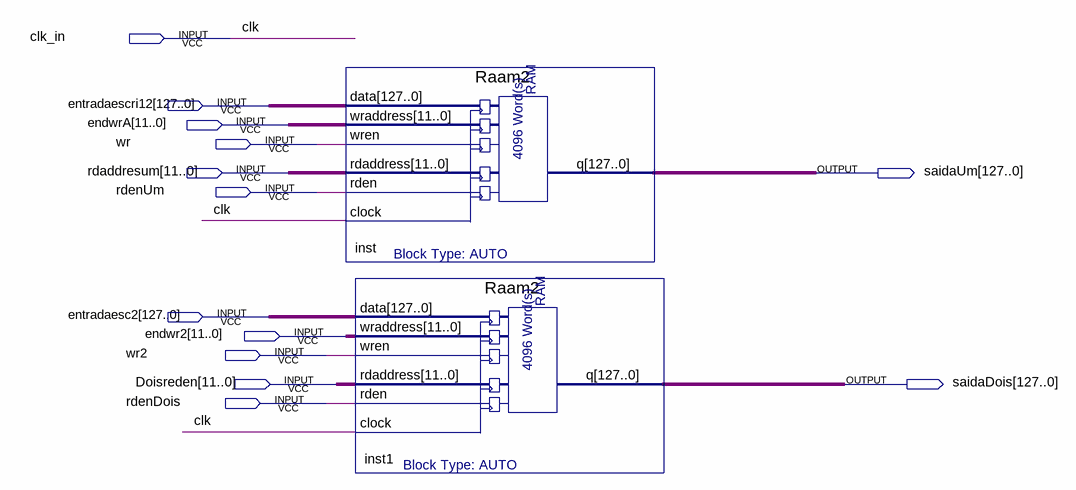
[diagram p0: schematic sheet]
// Quartus schematic DualRam2.bdf as structural Verilog: 2 symbols, 13 pins
module DualRam2 (
  input  clk_in,
  input  [127:0] entradaescri12,
  input  [11:0] endwrA,
  input  wr,
  input  [11:0] rdaddresum,
  input  rdenUm,
  input  [127:0] entradaesc2,
  input  [11:0] endwr2,
  input  wr2,
  input  [11:0] Doisreden,
  input  rdenDois,
  output [127:0] saidaUm,
  output [127:0] saidaDois
);

  Raam2 inst (
    .data(entradaescri12), .wraddress(endwrA), .wren(wr), .rdaddress(rdaddresum), .rden(rdenUm),
    .clock(clk_in), .q(saidaUm));
  Raam2 inst1 (
    .data(entradaesc2), .wraddress(endwr2), .wren(wr2), .rdaddress(Doisreden), .rden(rdenDois),
    .clock(clk_in), .q(saidaDois));

  // Other names for the same wires on the sheet: clk = clk_in
endmodule
